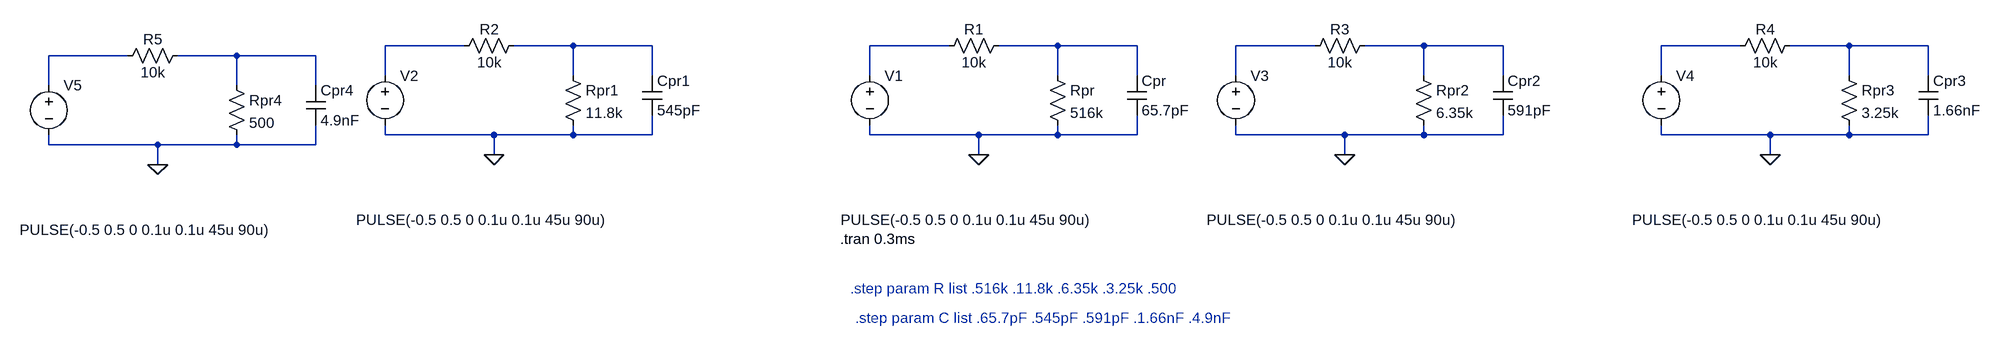
[diagram p0: schematic Simu_probe.asc]
Simu_probe.asc, the LTspice schematic file:
Version 4
SHEET 1 1696 680
WIRE -768 -48 -896 -48
WIRE -592 -48 -688 -48
WIRE -464 -48 -592 -48
WIRE 16 -48 -112 -48
WIRE 192 -48 96 -48
WIRE 320 -48 192 -48
WIRE 608 -48 480 -48
WIRE 784 -48 688 -48
WIRE 912 -48 784 -48
WIRE 1296 -48 1168 -48
WIRE 1472 -48 1376 -48
WIRE 1600 -48 1472 -48
WIRE -1312 -32 -1440 -32
WIRE -1136 -32 -1232 -32
WIRE -1008 -32 -1136 -32
WIRE -896 0 -896 -48
WIRE -592 0 -592 -48
WIRE -464 0 -464 -48
WIRE -112 0 -112 -48
WIRE 192 0 192 -48
WIRE 320 0 320 -48
WIRE 480 0 480 -48
WIRE 784 0 784 -48
WIRE 912 0 912 -48
WIRE 1168 0 1168 -48
WIRE 1472 0 1472 -48
WIRE 1600 0 1600 -48
WIRE -1440 16 -1440 -32
WIRE -1136 16 -1136 -32
WIRE -1008 16 -1008 -32
WIRE -896 96 -896 80
WIRE -720 96 -896 96
WIRE -592 96 -592 80
WIRE -592 96 -720 96
WIRE -464 96 -464 64
WIRE -464 96 -592 96
WIRE -112 96 -112 80
WIRE 64 96 -112 96
WIRE 192 96 192 80
WIRE 192 96 64 96
WIRE 320 96 320 64
WIRE 320 96 192 96
WIRE 480 96 480 80
WIRE 656 96 480 96
WIRE 784 96 784 80
WIRE 784 96 656 96
WIRE 912 96 912 64
WIRE 912 96 784 96
WIRE 1168 96 1168 80
WIRE 1344 96 1168 96
WIRE 1472 96 1472 80
WIRE 1472 96 1344 96
WIRE 1600 96 1600 64
WIRE 1600 96 1472 96
WIRE -1440 112 -1440 96
WIRE -1264 112 -1440 112
WIRE -1136 112 -1136 96
WIRE -1136 112 -1264 112
WIRE -1008 112 -1008 80
WIRE -1008 112 -1136 112
WIRE -720 128 -720 96
WIRE 64 128 64 96
WIRE 656 128 656 96
WIRE 1344 128 1344 96
WIRE -1264 144 -1264 112
FLAG 64 128 0
FLAG -720 128 0
FLAG 656 128 0
FLAG 1344 128 0
FLAG -1264 144 0
SYMBOL voltage -112 -16 R0
WINDOW 3 -47 249 Left 2
WINDOW 123 -155 164 Left 2
WINDOW 39 0 0 Left 2
SYMATTR Value PULSE(-0.5 0.5 0 0.1u 0.1u 45u 90u)
SYMATTR InstName V1
SYMBOL res 0 -32 R270
WINDOW 0 27 56 VTop 2
WINDOW 3 5 56 VBottom 2
SYMATTR InstName R1
SYMATTR Value 10k
SYMBOL res 176 -16 R0
SYMATTR InstName Rpr
SYMATTR Value 516k
SYMBOL cap 304 0 R0
SYMATTR InstName Cpr
SYMATTR Value 65.7pF
SYMBOL voltage -896 -16 R0
WINDOW 3 -47 249 Left 2
WINDOW 123 -155 164 Left 2
WINDOW 39 0 0 Left 2
SYMATTR Value PULSE(-0.5 0.5 0 0.1u 0.1u 45u 90u)
SYMATTR InstName V2
SYMBOL res -784 -32 R270
WINDOW 0 27 56 VTop 2
WINDOW 3 5 56 VBottom 2
SYMATTR InstName R2
SYMATTR Value 10k
SYMBOL res -608 -16 R0
SYMATTR InstName Rpr1
SYMATTR Value 11.8k
SYMBOL cap -480 0 R0
SYMATTR InstName Cpr1
SYMATTR Value 545pF
SYMBOL voltage 480 -16 R0
WINDOW 3 -47 249 Left 2
WINDOW 123 -155 164 Left 2
WINDOW 39 0 0 Left 2
SYMATTR Value PULSE(-0.5 0.5 0 0.1u 0.1u 45u 90u)
SYMATTR InstName V3
SYMBOL res 592 -32 R270
WINDOW 0 27 56 VTop 2
WINDOW 3 5 56 VBottom 2
SYMATTR InstName R3
SYMATTR Value 10k
SYMBOL res 768 -16 R0
SYMATTR InstName Rpr2
SYMATTR Value 6.35k
SYMBOL cap 896 0 R0
SYMATTR InstName Cpr2
SYMATTR Value 591pF
SYMBOL voltage 1168 -16 R0
WINDOW 3 -47 249 Left 2
WINDOW 123 -155 164 Left 2
WINDOW 39 0 0 Left 2
SYMATTR Value PULSE(-0.5 0.5 0 0.1u 0.1u 45u 90u)
SYMATTR InstName V4
SYMBOL res 1280 -32 R270
WINDOW 0 27 56 VTop 2
WINDOW 3 5 56 VBottom 2
SYMATTR InstName R4
SYMATTR Value 10k
SYMBOL res 1456 -16 R0
SYMATTR InstName Rpr3
SYMATTR Value 3.25k
SYMBOL cap 1584 0 R0
SYMATTR InstName Cpr3
SYMATTR Value 1.66nF
SYMBOL voltage -1440 0 R0
WINDOW 3 -47 249 Left 2
WINDOW 123 -155 164 Left 2
WINDOW 39 0 0 Left 2
SYMATTR Value PULSE(-0.5 0.5 0 0.1u 0.1u 45u 90u)
SYMATTR InstName V5
SYMBOL res -1328 -16 R270
WINDOW 0 27 56 VTop 2
WINDOW 3 5 56 VBottom 2
SYMATTR InstName R5
SYMATTR Value 10k
SYMBOL res -1152 0 R0
SYMATTR InstName Rpr4
SYMATTR Value 500
SYMBOL cap -1024 16 R0
SYMATTR InstName Cpr4
SYMATTR Value 4.9nF
TEXT -160 264 Left 2 !.tran 0.3ms
TEXT -144 344 Left 2 ;.step param R list .516k .11.8k .6.35k .3.25k .500
TEXT -136 392 Left 2 ;.step param C list .65.7pF .545pF .591pF .1.66nF .4.9nF

The netlist it stands for:
* Simu_probe.asc
V1 N003 0 PULSE(-0.5 0.5 0 0.1u 0.1u 45u 90u)
R1 N003 N004 10k
Rpr N004 0 516k
Cpr N004 0 65.7pF
V2 N001 0 PULSE(-0.5 0.5 0 0.1u 0.1u 45u 90u)
R2 N001 N002 10k
Rpr1 N002 0 11.8k
Cpr1 N002 0 545pF
V3 N005 0 PULSE(-0.5 0.5 0 0.1u 0.1u 45u 90u)
R3 N005 N006 10k
Rpr2 N006 0 6.35k
Cpr2 N006 0 591pF
V4 N007 0 PULSE(-0.5 0.5 0 0.1u 0.1u 45u 90u)
R4 N007 N008 10k
Rpr3 N008 0 3.25k
Cpr3 N008 0 1.66nF
V5 N009 0 PULSE(-0.5 0.5 0 0.1u 0.1u 45u 90u)
R5 N009 N010 10k
Rpr4 N010 0 500
Cpr4 N010 0 4.9nF
.tran 0.3ms
* .step param R list .516k .11.8k .6.35k .3.25k .500
* .step param C list .65.7pF .545pF .591pF .1.66nF .4.9nF
.backanno
.end